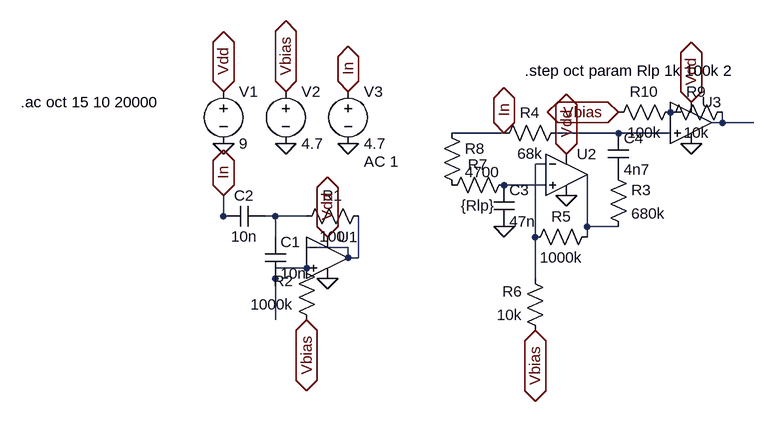
[diagram p0: schematic OverdriveChonkFilter.asc]
OverdriveChonkFilter.asc, the LTspice schematic file:
Version 4
SHEET 1 880 680
WIRE 800 0 800 -16
WIRE 800 0 784 0
WIRE 848 0 800 0
WIRE 464 16 384 16
WIRE 640 16 544 16
WIRE 720 16 640 16
WIRE 528 64 512 64
WIRE 528 96 464 96
WIRE 32 144 32 112
WIRE 48 144 32 144
WIRE 112 144 96 144
WIRE 160 144 112 144
WIRE 592 160 592 80
WIRE 640 160 592 160
WIRE 112 176 112 144
WIRE 512 176 512 64
WIRE 592 176 592 160
WIRE 224 192 160 192
WIRE 224 208 224 192
WIRE 240 208 240 144
WIRE 240 208 224 208
WIRE 160 224 112 224
WIRE 112 240 112 224
WIRE 512 240 512 176
WIRE 112 304 112 240
FLAG 128 32 0
FLAG 32 32 0
FLAG 224 32 0
FLAG 32 -48 Vdd
IOPIN 32 -48 BiDir
FLAG 128 -48 Vbias
IOPIN 128 -48 BiDir
FLAG 224 -48 In
IOPIN 224 -48 BiDir
FLAG 32 112 In
IOPIN 32 112 BiDir
FLAG 192 176 Vdd
IOPIN 192 176 BiDir
FLAG 192 240 0
FLAG 160 304 Vbias
IOPIN 160 304 BiDir
FLAG 464 16 In
IOPIN 464 16 BiDir
FLAG 464 160 0
FLAG 560 112 0
FLAG 560 48 Vdd
IOPIN 560 48 BiDir
FLAG 512 320 Vbias
IOPIN 512 320 BiDir
FLAG 752 32 0
FLAG 752 -32 Vdd
IOPIN 752 -32 BiDir
FLAG 640 -16 Vbias
IOPIN 640 -16 BiDir
SYMBOL voltage 32 -64 R0
WINDOW 123 0 0 Left 0
WINDOW 39 0 0 Left 0
SYMATTR InstName V1
SYMATTR Value 9
SYMBOL voltage 128 -64 R0
WINDOW 123 0 0 Left 0
WINDOW 39 0 0 Left 0
SYMATTR InstName V2
SYMATTR Value 4.7
SYMBOL voltage 224 -64 R0
WINDOW 123 24 124 Left 2
WINDOW 39 0 0 Left 0
SYMATTR InstName V3
SYMATTR Value 4.7
SYMATTR Value2 AC 1
SYMBOL Opamps\\UniversalOpamp2 192 208 R0
SYMATTR InstName U1
SYMBOL res 256 128 R90
WINDOW 0 0 56 VBottom 2
WINDOW 3 32 56 VTop 2
SYMATTR InstName R1
SYMATTR Value 100
SYMBOL res 176 320 R180
WINDOW 0 36 76 Left 2
WINDOW 3 36 40 Left 2
SYMATTR InstName R2
SYMATTR Value 1000k
SYMBOL cap 96 176 R0
SYMATTR InstName C1
SYMATTR Value 10n
SYMBOL cap 448 96 R0
SYMATTR InstName C3
SYMATTR Value 47n
SYMBOL res 560 0 R90
WINDOW 0 0 56 VBottom 2
WINDOW 3 32 56 VTop 2
SYMATTR InstName R4
SYMATTR Value 68k
SYMBOL Opamps\\UniversalOpamp2 560 80 R0
SYMATTR InstName U2
SYMBOL res 608 160 R90
WINDOW 0 0 56 VBottom 2
WINDOW 3 32 56 VTop 2
SYMATTR InstName R5
SYMATTR Value 1000k
SYMBOL res 528 336 R180
WINDOW 0 36 76 Left 2
WINDOW 3 36 40 Left 2
SYMATTR InstName R6
SYMATTR Value 10k
SYMBOL res 480 80 R90
WINDOW 0 0 56 VBottom 2
WINDOW 3 32 56 VTop 2
SYMATTR InstName R7
SYMATTR Value {Rlp}
SYMBOL res 368 0 R0
SYMATTR InstName R8
SYMATTR Value 4700
SYMBOL res 624 64 R0
SYMATTR InstName R3
SYMATTR Value 680k
SYMBOL Opamps\\UniversalOpamp2 752 0 R0
SYMATTR InstName U3
SYMBOL res 816 -32 R90
WINDOW 0 0 56 VBottom 2
WINDOW 3 32 56 VTop 2
SYMATTR InstName R9
SYMATTR Value 10k
SYMBOL res 736 -32 R90
WINDOW 0 0 56 VBottom 2
WINDOW 3 32 56 VTop 2
SYMATTR InstName R10
SYMATTR Value 100k
SYMBOL cap 624 16 R0
SYMATTR InstName C4
SYMATTR Value 4n7
SYMBOL cap 96 128 R90
WINDOW 0 0 32 VBottom 2
WINDOW 3 32 32 VTop 2
SYMATTR InstName C2
SYMATTR Value 10n
TEXT -280 -32 Left 2 !.ac oct 15 10 20000
TEXT 496 -80 Left 2 !.step oct param Rlp 1k 100k 2

The netlist it stands for:
* OverdriveChonkFilter.asc
V1 Vdd 0 9
V2 Vbias 0 4.7
V3 In 0 4.7 AC 1
XU1 N008 N007 Vdd 0 N007 level.2 Avol=1Meg GBW=10Meg Slew=10Meg ilimit=25m rail=0 Vos=0 phimargin=45 en=0 enk=0 in=0 ink=0 Rin=500Meg  ; pins IN+ IN- V+ V- OUT
R1 N007 N005 100
R2 Vbias N008 1000k
C1 N005 N008 10n
C3 N004 0 47n
R4 N002 In 68k
XU2 N004 N003 Vdd 0 N006 level.2 Avol=1Meg GBW=10Meg Slew=10Meg ilimit=25m rail=0 Vos=0 phimargin=45 en=0 enk=0 in=0 ink=0 Rin=500Meg  ; pins IN+ IN- V+ V- OUT
R5 N006 N003 1000k
R6 Vbias N003 10k
R7 N004 P001 {Rlp}
R8 In P001 4700
R3 P002 N006 680k
XU3 N002 P003 Vdd 0 N001 level.2 Avol=1Meg GBW=10Meg Slew=10Meg ilimit=25m rail=0 Vos=0 phimargin=45 en=0 enk=0 in=0 ink=0 Rin=500Meg  ; pins IN+ IN- V+ V- OUT
R9 N001 P003 10k
R10 P003 Vbias 100k
C4 N002 P002 4n7
C2 N005 In 10n
.ac oct 15 10 20000
.step oct param Rlp 1k 100k 2
.lib UniversalOpamps2.sub
.backanno
.end